# EAGLE schematic ds3231M-breakout (EAGLE 7.2.0)
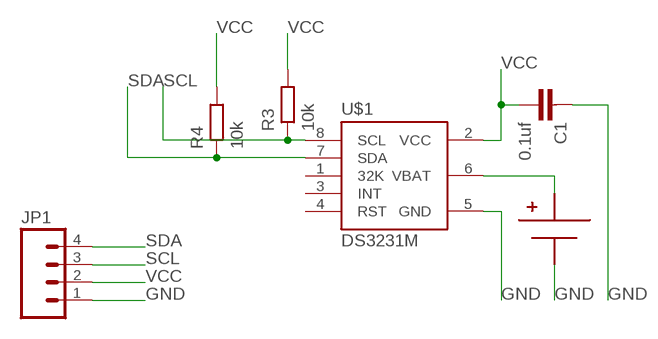
[diagram p0: schematic, sheet 1]

## Parts
C1  0.1uf  CAPACITOR0603-N  [C0603-N]
JP1  M04LONGPADS  [1X04_LONGPADS]
R3  10k  RESISTOR0603-N  [R0603-N]
R4  10k  RESISTOR0603-N  [R0603-N]
U$1  DS3231M  [SO08]
U$2  LINX_2032BAT_HLDER  [LINX_2032BAT_HLDER]

## Nets
GND: C1.1 JP1.1 U$1.5(GND) U$2.P$1(BAT_NEG)
N$2: U$1.6(VBAT) U$2.BAT_POS$1(BAT_POS) U$2.BAT_POS$2(BAT_POS) U$2.BAT_POS$3(BAT_POS) U$2.BAT_POS$4(BAT_POS)
SCL: JP1.3 R3.1 U$1.8(SCL)
SDA: JP1.4 R4.1 U$1.7(SDA)
VCC: C1.2 JP1.2 R3.2 R4.2 U$1.2(VCC)
Unconnected: U$1.1(32K) U$1.3(INT) U$1.4(RST)

## Library data of the parts
C1 = passives-7351:CAPACITOR
JP1 = SparkFun-Connectors:M04: Header 4 Standard 4-pin 0.1" header. Use with straight break away headers (SKU : PRT-00116), right angle break away headers (PRT-00553), swiss pins (PRT-00743), machine pins (PRT-00117), and female headers (PRT-00115). Molex polarized connector foot print use with SKU : PRT-08231 with associated crimp pins and housings. 1MM SMD Version SKU: PRT-10208
R3 R4 = passives-7351:RESISTOR
U$1 = _my-parts:DS3231M: The DS3231M is a low-cost, extremely accurate, I2C realtime clock (RTC). Datasheet <https://datasheets.maximintegrated.com/en/ds/DS3231M.pdf>
U$2 = _my-parts:LINX_2032BAT_HLDER